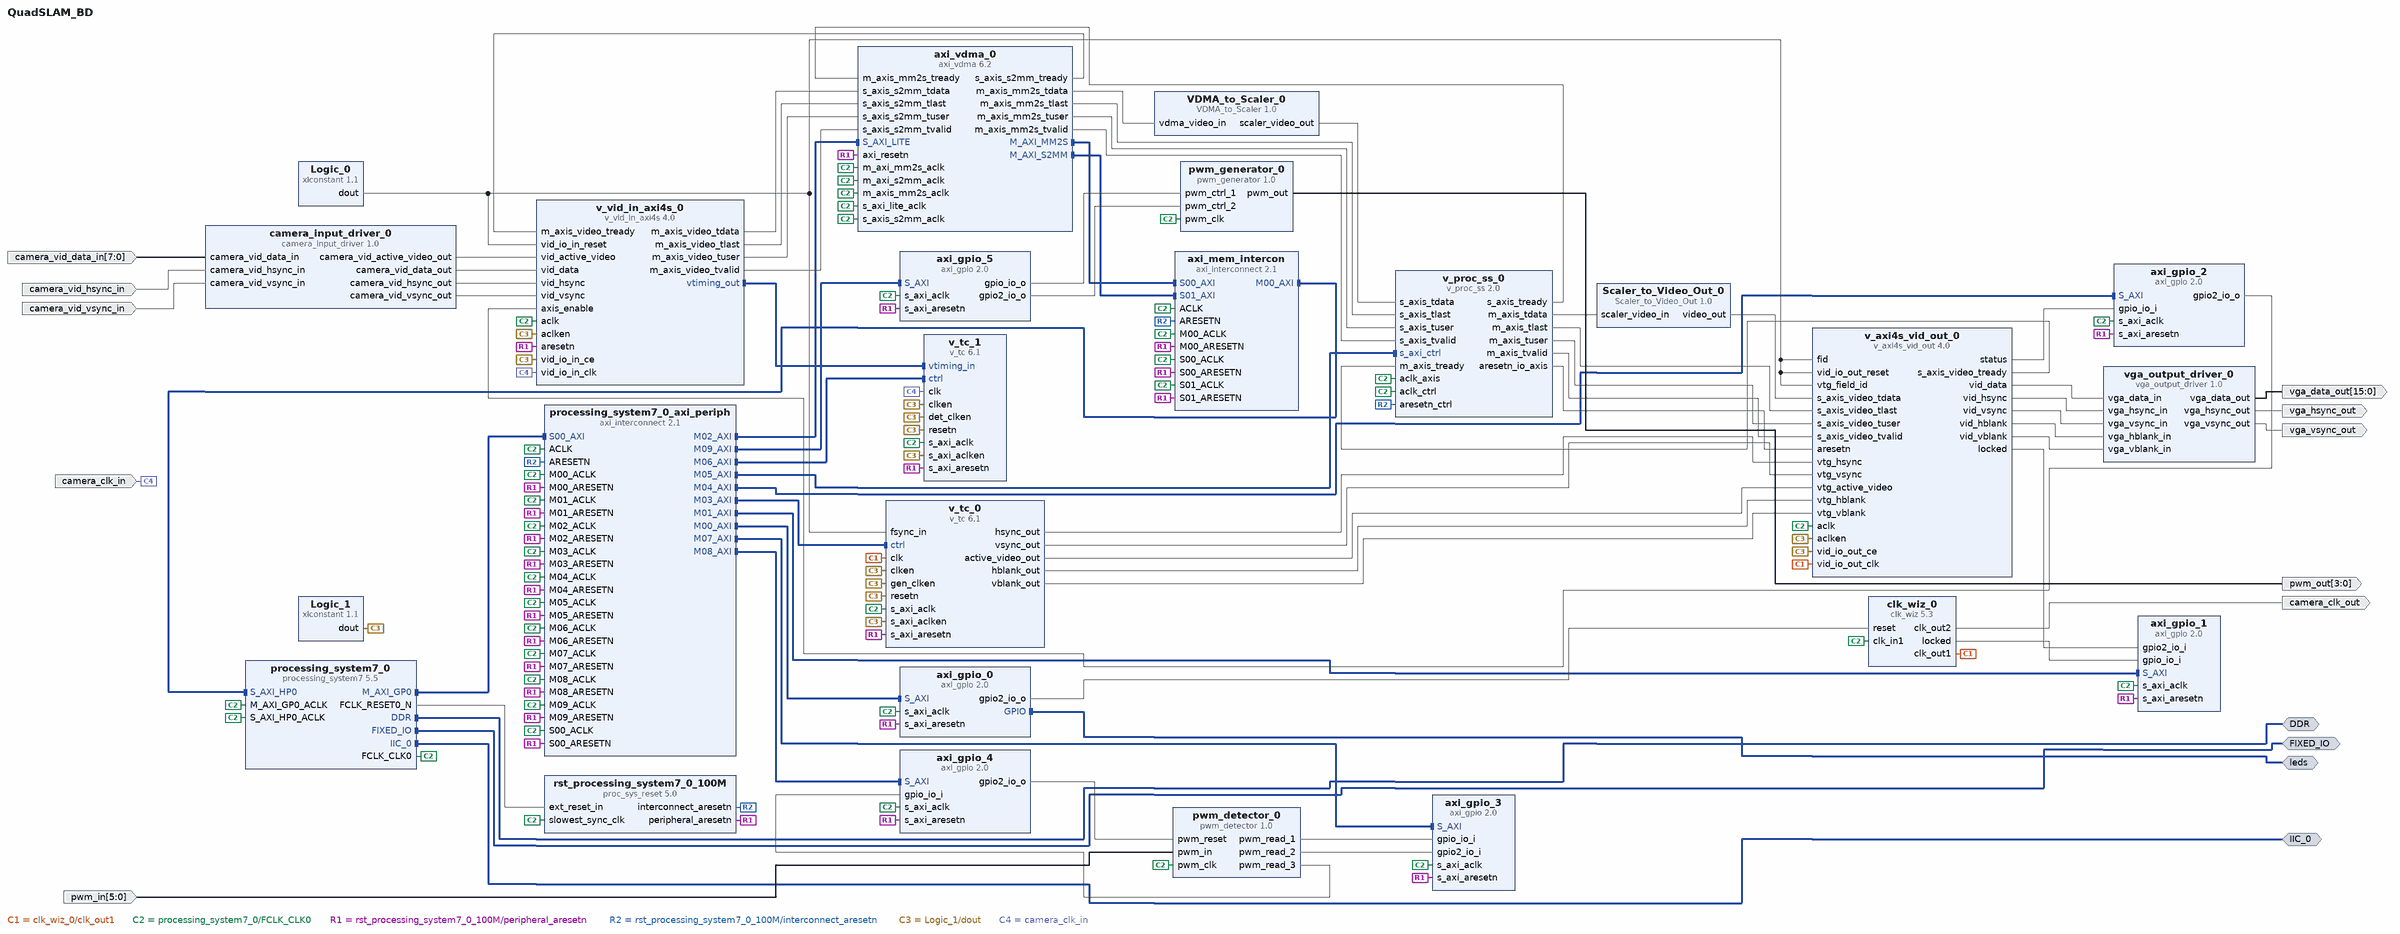
[diagram p0: block diagram of the top level]
# Vivado block design QuadSLAM_BD, Vivado 2016.2
create_bd_design QuadSLAM_BD

create_bd_intf_port -mode Master -vlnv xilinx.com:interface:ddrx_rtl:1.0 DDR
create_bd_intf_port -mode Master -vlnv xilinx.com:display_processing_system7:fixedio_rtl:1.0 FIXED_IO
create_bd_intf_port -mode Master -vlnv xilinx.com:interface:gpio_rtl:1.0 leds
create_bd_intf_port -mode Master -vlnv xilinx.com:interface:iic_rtl:1.0 IIC_0
create_bd_port -dir O -from 15 -to 0 vga_data_out
create_bd_port -dir O vga_hsync_out
create_bd_port -dir O vga_vsync_out
create_bd_port -dir I -from 7 -to 0 camera_vid_data_in
create_bd_port -dir I camera_vid_hsync_in
create_bd_port -dir I camera_vid_vsync_in
create_bd_port -dir I -type clk camera_clk_in
set_property -dict {CONFIG.FREQ_HZ 74250000} [get_bd_ports camera_clk_in]
create_bd_port -dir O -type clk camera_clk_out
create_bd_port -dir O -from 3 -to 0 pwm_out
create_bd_port -dir I -from 5 -to 0 pwm_in

create_bd_cell -type ip -vlnv xilinx.com:ip:processing_system7:5.5 processing_system7_0
set_property -dict [list \
  CONFIG.PCW_FPGA0_PERIPHERAL_FREQMHZ 130 \
  CONFIG.PCW_USE_S_AXI_HP0 1 \
  CONFIG.PCW_IMPORT_BOARD_PRESET C:/Users/NicholasKimball/Documents/School/Senior/CPE439/fpga-zynq-master/zybo/src/xml/ZYBO_zynq_def.xml \
  CONFIG.PCW_QSPI_GRP_SINGLE_SS_ENABLE 1 \
  CONFIG.PCW_WDT_PERIPHERAL_ENABLE 1 \
  CONFIG.PCW_TTC0_PERIPHERAL_ENABLE 1 \
  CONFIG.PCW_I2C1_PERIPHERAL_ENABLE 1 \
  CONFIG.PCW_I2C1_I2C1_IO {MIO 12 .. 13} \
] [get_bd_cells processing_system7_0]
# 2 more settings of processing_system7_0 are not shown: defaults, MIO pin electricals, DDR timing, and values the tool derives
create_bd_cell -type ip -vlnv xilinx.com:ip:axi_gpio:2.0 axi_gpio_0
set_property -dict [list \
  CONFIG.C_GPIO_WIDTH 4 \
  CONFIG.C_GPIO2_WIDTH 1 \
  CONFIG.C_IS_DUAL 1 \
  CONFIG.C_ALL_INPUTS_2 0 \
  CONFIG.C_ALL_OUTPUTS 1 \
  CONFIG.C_ALL_OUTPUTS_2 1 \
] [get_bd_cells axi_gpio_0]
create_bd_cell -type ip -vlnv xilinx.com:ip:proc_sys_reset:5.0 rst_processing_system7_0_100M
create_bd_cell -type ip -vlnv xilinx.com:ip:axi_gpio:2.0 axi_gpio_1
set_property -dict [list \
  CONFIG.C_GPIO_WIDTH 1 \
  CONFIG.C_GPIO2_WIDTH 1 \
  CONFIG.C_IS_DUAL 1 \
  CONFIG.C_ALL_INPUTS 1 \
  CONFIG.C_ALL_INPUTS_2 1 \
] [get_bd_cells axi_gpio_1]
create_bd_cell -type ip -vlnv xilinx.com:ip:axi_vdma:6.2 axi_vdma_0
set_property -dict [list \
  CONFIG.c_m_axis_mm2s_tdata_width 16 \
  CONFIG.c_include_s2mm_dre 1 \
  CONFIG.c_num_fstores 3 \
  CONFIG.c_use_s2mm_fsync 0 \
  CONFIG.c_s2mm_genlock_mode 2 \
  CONFIG.c_mm2s_linebuffer_depth 256 \
  CONFIG.c_s2mm_linebuffer_depth 256 \
  CONFIG.c_mm2s_max_burst_length 64 \
  CONFIG.c_s2mm_max_burst_length 64 \
  CONFIG.c_include_s2mm 1 \
  CONFIG.c_include_mm2s_dre 1 \
] [get_bd_cells axi_vdma_0]
create_bd_cell -type ip -vlnv xilinx.com:ip:v_tc:6.1 v_tc_0
set_property -dict [list \
  CONFIG.max_clocks_per_line 2048 \
  CONFIG.max_lines_per_frame 1024 \
  CONFIG.VIDEO_MODE 1024x768p \
  CONFIG.GEN_HSYNC_POLARITY Low \
  CONFIG.GEN_VSYNC_POLARITY Low \
  CONFIG.GEN_HBLANK_POLARITY Low \
  CONFIG.GEN_VBLANK_POLARITY Low \
  CONFIG.enable_detection false \
  CONFIG.vertical_blank_generation true \
  CONFIG.horizontal_blank_generation true \
  CONFIG.frame_syncs 1 \
] [get_bd_cells v_tc_0]
create_bd_cell -type ip -vlnv xilinx.com:ip:v_axi4s_vid_out:4.0 v_axi4s_vid_out_0
set_property -dict [list \
  CONFIG.C_PIXELS_PER_CLOCK 1 \
  CONFIG.C_S_AXIS_VIDEO_FORMAT 12 \
  CONFIG.C_S_AXIS_VIDEO_DATA_WIDTH 16 \
  CONFIG.C_NATIVE_COMPONENT_WIDTH 16 \
  CONFIG.C_HAS_ASYNC_CLK 1 \
  CONFIG.C_ADDR_WIDTH 5 \
  CONFIG.C_VTG_MASTER_SLAVE 1 \
] [get_bd_cells v_axi4s_vid_out_0]
create_bd_cell -type ip -vlnv xilinx.com:ip:xlconstant:1.1 Logic_0
set_property -dict {CONFIG.CONST_WIDTH 1 CONFIG.CONST_VAL 0} [get_bd_cells Logic_0]
create_bd_cell -type ip -vlnv xilinx.com:ip:xlconstant:1.1 Logic_1
create_bd_cell -type ip -vlnv xilinx.com:ip:axi_interconnect:2.1 processing_system7_0_axi_periph
set_property -dict {CONFIG.NUM_MI 10} [get_bd_cells processing_system7_0_axi_periph]
create_bd_cell -type ip -vlnv xilinx.com:ip:clk_wiz:5.3 clk_wiz_0
set_property -dict [list \
  CONFIG.CLKOUT2_USED true \
  CONFIG.NUM_OUT_CLKS 2 \
  CONFIG.CLKOUT1_REQUESTED_OUT_FREQ 65 \
  CONFIG.CLKOUT2_REQUESTED_OUT_FREQ 39.321 \
  CONFIG.PRIM_SOURCE No_buffer \
  CONFIG.CLKOUT1_DRIVES BUFGCE \
  CONFIG.CLKOUT2_DRIVES BUFGCE \
  CONFIG.CLKOUT3_DRIVES BUFGCE \
  CONFIG.CLKOUT4_DRIVES BUFGCE \
  CONFIG.CLKOUT5_DRIVES BUFGCE \
  CONFIG.CLKOUT6_DRIVES BUFGCE \
  CONFIG.CLKOUT7_DRIVES BUFGCE \
  CONFIG.FEEDBACK_SOURCE FDBK_AUTO \
  CONFIG.MMCM_DIVCLK_DIVIDE 5 \
  CONFIG.MMCM_CLKFBOUT_MULT_F 47.125 \
  CONFIG.MMCM_CLKOUT0_DIVIDE_F 18.125 \
  CONFIG.MMCM_CLKOUT1_DIVIDE 30 \
  CONFIG.USE_SAFE_CLOCK_STARTUP true \
  CONFIG.CLKOUT1_JITTER 193.721 \
  CONFIG.CLKOUT1_PHASE_ERROR 222.858 \
  CONFIG.CLKOUT2_JITTER 209.162 \
  CONFIG.CLKOUT2_PHASE_ERROR 222.858 \
] [get_bd_cells clk_wiz_0]
create_bd_cell -type ip -vlnv xilinx.com:ip:axi_interconnect:2.1 axi_mem_intercon
set_property -dict {CONFIG.NUM_SI 2 CONFIG.NUM_MI 1} [get_bd_cells axi_mem_intercon]
create_bd_cell -type ip -vlnv xilinx.com:ip:axi_gpio:2.0 axi_gpio_2
set_property -dict [list \
  CONFIG.C_GPIO2_WIDTH 1 \
  CONFIG.C_IS_DUAL 1 \
  CONFIG.C_ALL_INPUTS 1 \
  CONFIG.C_ALL_OUTPUTS_2 1 \
] [get_bd_cells axi_gpio_2]
create_bd_cell -type ip -vlnv xilinx.com:ip:v_vid_in_axi4s:4.0 v_vid_in_axi4s_0
set_property -dict [list \
  CONFIG.C_M_AXIS_VIDEO_FORMAT 12 \
  CONFIG.C_M_AXIS_VIDEO_DATA_WIDTH 8 \
  CONFIG.C_HAS_ASYNC_CLK 1 \
] [get_bd_cells v_vid_in_axi4s_0]
create_bd_cell -type ip -vlnv xilinx.com:user:vga_output_driver:1.0 vga_output_driver_0
create_bd_cell -type ip -vlnv xilinx.com:user:camera_input_driver:1.0 camera_input_driver_0
create_bd_cell -type ip -vlnv xilinx.com:user:Scaler_to_Video_Out:1.0 Scaler_to_Video_Out_0
create_bd_cell -type ip -vlnv xilinx.com:ip:v_proc_ss:2.0 v_proc_ss_0
set_property -dict [list \
  CONFIG.C_SCALER_ALGORITHM 1 \
  CONFIG.C_TOPOLOGY 0 \
  CONFIG.C_SAMPLES_PER_CLK 1 \
  CONFIG.C_MAX_DATA_WIDTH 8 \
  CONFIG.C_MAX_COLS 2560 \
  CONFIG.C_MAX_ROWS 2048 \
  CONFIG.C_ENABLE_INTERLACED false \
  CONFIG.C_ENABLE_DMA false \
  CONFIG.C_SCALER_ENABLE_422 false \
  CONFIG.C_DEINT_MOTION_ADAPTIVE false \
] [get_bd_cells v_proc_ss_0]
create_bd_cell -type ip -vlnv xilinx.com:user:VDMA_to_Scaler:1.0 VDMA_to_Scaler_0
create_bd_cell -type ip -vlnv xilinx.com:ip:v_tc:6.1 v_tc_1
set_property -dict [list \
  CONFIG.max_clocks_per_line 4096 \
  CONFIG.max_lines_per_frame 1024 \
  CONFIG.horizontal_blank_detection false \
  CONFIG.enable_generation false \
  CONFIG.vertical_blank_detection false \
] [get_bd_cells v_tc_1]
create_bd_cell -type ip -vlnv xilinx.com:ip:axi_gpio:2.0 axi_gpio_3
set_property -dict [list \
  CONFIG.C_GPIO_WIDTH 22 \
  CONFIG.C_GPIO2_WIDTH 22 \
  CONFIG.C_IS_DUAL 1 \
  CONFIG.C_ALL_INPUTS 1 \
  CONFIG.C_ALL_INPUTS_2 1 \
] [get_bd_cells axi_gpio_3]
create_bd_cell -type ip -vlnv xilinx.com:ip:axi_gpio:2.0 axi_gpio_4
set_property -dict [list \
  CONFIG.C_GPIO_WIDTH 22 \
  CONFIG.C_GPIO2_WIDTH 1 \
  CONFIG.C_IS_DUAL 1 \
  CONFIG.C_ALL_INPUTS 1 \
  CONFIG.C_ALL_OUTPUTS_2 1 \
] [get_bd_cells axi_gpio_4]
create_bd_cell -type ip -vlnv xilinx.com:ip:axi_gpio:2.0 axi_gpio_5
set_property -dict [list \
  CONFIG.C_GPIO_WIDTH 24 \
  CONFIG.C_GPIO2_WIDTH 22 \
  CONFIG.C_IS_DUAL 1 \
  CONFIG.C_ALL_OUTPUTS 1 \
  CONFIG.C_ALL_OUTPUTS_2 1 \
] [get_bd_cells axi_gpio_5]
create_bd_cell -type ip -vlnv xilinx.com:user:pwm_detector:1.0 pwm_detector_0
create_bd_cell -type ip -vlnv xilinx.com:user:pwm_generator:1.0 pwm_generator_0

# ---- connections ----

connect_bd_intf_net [get_bd_intf_pins processing_system7_0/M_AXI_GP0] [get_bd_intf_pins processing_system7_0_axi_periph/S00_AXI]
connect_bd_intf_net [get_bd_intf_pins processing_system7_0_axi_periph/M00_AXI] [get_bd_intf_pins axi_gpio_0/S_AXI]
connect_bd_intf_net [get_bd_intf_pins processing_system7_0_axi_periph/M01_AXI] [get_bd_intf_pins axi_gpio_1/S_AXI]
connect_bd_intf_net [get_bd_intf_pins processing_system7_0_axi_periph/M02_AXI] [get_bd_intf_pins axi_vdma_0/S_AXI_LITE]
connect_bd_intf_net [get_bd_intf_pins processing_system7_0_axi_periph/M03_AXI] [get_bd_intf_pins v_tc_0/ctrl]
connect_bd_intf_net [get_bd_intf_pins axi_vdma_0/M_AXI_MM2S] [get_bd_intf_pins axi_mem_intercon/S00_AXI]
connect_bd_intf_net [get_bd_intf_pins axi_mem_intercon/M00_AXI] [get_bd_intf_pins processing_system7_0/S_AXI_HP0]
connect_bd_intf_net [get_bd_intf_pins processing_system7_0_axi_periph/M04_AXI] [get_bd_intf_pins axi_gpio_2/S_AXI]
connect_bd_intf_net [get_bd_intf_pins axi_vdma_0/M_AXI_S2MM] [get_bd_intf_pins axi_mem_intercon/S01_AXI]
connect_bd_intf_net [get_bd_intf_pins processing_system7_0_axi_periph/M05_AXI] [get_bd_intf_pins v_proc_ss_0/s_axi_ctrl]
connect_bd_intf_net [get_bd_intf_pins v_vid_in_axi4s_0/vtiming_out] [get_bd_intf_pins v_tc_1/vtiming_in]
connect_bd_intf_net [get_bd_intf_pins processing_system7_0_axi_periph/M06_AXI] [get_bd_intf_pins v_tc_1/ctrl]
connect_bd_intf_net [get_bd_intf_pins processing_system7_0_axi_periph/M07_AXI] [get_bd_intf_pins axi_gpio_3/S_AXI]
connect_bd_intf_net [get_bd_intf_pins processing_system7_0_axi_periph/M08_AXI] [get_bd_intf_pins axi_gpio_4/S_AXI]
connect_bd_intf_net [get_bd_intf_pins processing_system7_0_axi_periph/M09_AXI] [get_bd_intf_pins axi_gpio_5/S_AXI]
connect_bd_intf_net [get_bd_intf_ports DDR] [get_bd_intf_pins processing_system7_0/DDR]
connect_bd_intf_net [get_bd_intf_ports FIXED_IO] [get_bd_intf_pins processing_system7_0/FIXED_IO]
connect_bd_intf_net [get_bd_intf_ports leds] [get_bd_intf_pins axi_gpio_0/GPIO]
connect_bd_intf_net [get_bd_intf_ports IIC_0] [get_bd_intf_pins processing_system7_0/IIC_0]
connect_bd_net [get_bd_pins processing_system7_0/FCLK_RESET0_N] [get_bd_pins rst_processing_system7_0_100M/ext_reset_in]
connect_bd_net [get_bd_pins clk_wiz_0/clk_out1] [get_bd_pins v_tc_0/clk] [get_bd_pins v_axi4s_vid_out_0/vid_io_out_clk]
connect_bd_net [get_bd_pins processing_system7_0/FCLK_CLK0] \
  [get_bd_pins axi_vdma_0/s_axi_lite_aclk] [get_bd_pins rst_processing_system7_0_100M/slowest_sync_clk] \
  [get_bd_pins v_tc_0/s_axi_aclk] [get_bd_pins v_axi4s_vid_out_0/aclk] [get_bd_pins axi_vdma_0/m_axi_mm2s_aclk] \
  [get_bd_pins axi_vdma_0/m_axis_mm2s_aclk] [get_bd_pins axi_gpio_1/s_axi_aclk] [get_bd_pins axi_gpio_0/s_axi_aclk] \
  [get_bd_pins processing_system7_0/M_AXI_GP0_ACLK] [get_bd_pins clk_wiz_0/clk_in1] \
  [get_bd_pins processing_system7_0/S_AXI_HP0_ACLK] [get_bd_pins axi_gpio_2/s_axi_aclk] \
  [get_bd_pins axi_vdma_0/m_axi_s2mm_aclk] [get_bd_pins v_vid_in_axi4s_0/aclk] [get_bd_pins axi_vdma_0/s_axis_s2mm_aclk] \
  [get_bd_pins v_proc_ss_0/aclk_ctrl] [get_bd_pins v_proc_ss_0/aclk_axis] [get_bd_pins v_tc_1/s_axi_aclk] \
  [get_bd_pins axi_gpio_3/s_axi_aclk] [get_bd_pins axi_gpio_4/s_axi_aclk] [get_bd_pins axi_gpio_5/s_axi_aclk] \
  [get_bd_pins pwm_detector_0/pwm_clk] [get_bd_pins pwm_generator_0/pwm_clk] \
  [get_bd_pins processing_system7_0_axi_periph/S00_ACLK] [get_bd_pins processing_system7_0_axi_periph/ACLK] \
  [get_bd_pins processing_system7_0_axi_periph/M00_ACLK] [get_bd_pins processing_system7_0_axi_periph/M01_ACLK] \
  [get_bd_pins processing_system7_0_axi_periph/M02_ACLK] [get_bd_pins processing_system7_0_axi_periph/M03_ACLK] \
  [get_bd_pins axi_mem_intercon/S00_ACLK] [get_bd_pins axi_mem_intercon/ACLK] [get_bd_pins axi_mem_intercon/M00_ACLK] \
  [get_bd_pins processing_system7_0_axi_periph/M04_ACLK] [get_bd_pins axi_mem_intercon/S01_ACLK] \
  [get_bd_pins processing_system7_0_axi_periph/M05_ACLK] [get_bd_pins processing_system7_0_axi_periph/M06_ACLK] \
  [get_bd_pins processing_system7_0_axi_periph/M07_ACLK] [get_bd_pins processing_system7_0_axi_periph/M08_ACLK] \
  [get_bd_pins processing_system7_0_axi_periph/M09_ACLK]
connect_bd_net [get_bd_pins rst_processing_system7_0_100M/peripheral_aresetn] \
  [get_bd_pins axi_vdma_0/axi_resetn] [get_bd_pins v_tc_0/s_axi_aresetn] [get_bd_pins axi_gpio_0/s_axi_aresetn] \
  [get_bd_pins axi_gpio_1/s_axi_aresetn] [get_bd_pins axi_gpio_2/s_axi_aresetn] [get_bd_pins v_vid_in_axi4s_0/aresetn] \
  [get_bd_pins v_tc_1/s_axi_aresetn] [get_bd_pins axi_gpio_3/s_axi_aresetn] [get_bd_pins axi_gpio_4/s_axi_aresetn] \
  [get_bd_pins axi_gpio_5/s_axi_aresetn] [get_bd_pins processing_system7_0_axi_periph/S00_ARESETN] \
  [get_bd_pins processing_system7_0_axi_periph/M00_ARESETN] [get_bd_pins processing_system7_0_axi_periph/M01_ARESETN] \
  [get_bd_pins processing_system7_0_axi_periph/M02_ARESETN] [get_bd_pins processing_system7_0_axi_periph/M03_ARESETN] \
  [get_bd_pins axi_mem_intercon/S00_ARESETN] [get_bd_pins axi_mem_intercon/M00_ARESETN] \
  [get_bd_pins processing_system7_0_axi_periph/M04_ARESETN] [get_bd_pins axi_mem_intercon/S01_ARESETN] \
  [get_bd_pins processing_system7_0_axi_periph/M05_ARESETN] [get_bd_pins processing_system7_0_axi_periph/M06_ARESETN] \
  [get_bd_pins processing_system7_0_axi_periph/M07_ARESETN] [get_bd_pins processing_system7_0_axi_periph/M08_ARESETN] \
  [get_bd_pins processing_system7_0_axi_periph/M09_ARESETN]
connect_bd_net -net xlconstant_0_dout [get_bd_pins Logic_0/dout] \
  [get_bd_pins v_tc_0/fsync_in] [get_bd_pins v_axi4s_vid_out_0/vid_io_out_reset] [get_bd_pins v_axi4s_vid_out_0/fid] \
  [get_bd_pins v_axi4s_vid_out_0/vtg_field_id] [get_bd_pins v_vid_in_axi4s_0/vid_io_in_reset]
connect_bd_net [get_bd_pins rst_processing_system7_0_100M/interconnect_aresetn] \
  [get_bd_pins v_proc_ss_0/aresetn_ctrl] [get_bd_pins processing_system7_0_axi_periph/ARESETN] \
  [get_bd_pins axi_mem_intercon/ARESETN]
connect_bd_net [get_bd_pins clk_wiz_0/locked] [get_bd_pins axi_gpio_1/gpio_io_i]
connect_bd_net -net xlconstant_1_dout [get_bd_pins Logic_1/dout] \
  [get_bd_pins v_tc_0/clken] [get_bd_pins v_tc_0/s_axi_aclken] [get_bd_pins v_tc_0/resetn] \
  [get_bd_pins v_axi4s_vid_out_0/vid_io_out_ce] [get_bd_pins v_axi4s_vid_out_0/aclken] [get_bd_pins v_tc_0/gen_clken] \
  [get_bd_pins v_vid_in_axi4s_0/aclken] [get_bd_pins v_vid_in_axi4s_0/vid_io_in_ce] [get_bd_pins v_tc_1/resetn] \
  [get_bd_pins v_tc_1/det_clken] [get_bd_pins v_tc_1/s_axi_aclken] [get_bd_pins v_tc_1/clken]
connect_bd_net [get_bd_pins v_tc_0/hsync_out] [get_bd_pins v_axi4s_vid_out_0/vtg_hsync]
connect_bd_net [get_bd_pins v_tc_0/vsync_out] [get_bd_pins v_axi4s_vid_out_0/vtg_vsync]
connect_bd_net [get_bd_pins axi_gpio_0/gpio2_io_o] [get_bd_pins clk_wiz_0/reset]
connect_bd_net [get_bd_pins v_axi4s_vid_out_0/locked] [get_bd_pins axi_gpio_1/gpio2_io_i]
connect_bd_net [get_bd_pins v_axi4s_vid_out_0/status] [get_bd_pins axi_gpio_2/gpio_io_i]
connect_bd_net [get_bd_pins v_tc_0/active_video_out] [get_bd_pins v_axi4s_vid_out_0/vtg_active_video]
connect_bd_net [get_bd_pins v_tc_0/hblank_out] [get_bd_pins v_axi4s_vid_out_0/vtg_hblank]
connect_bd_net [get_bd_pins v_tc_0/vblank_out] [get_bd_pins v_axi4s_vid_out_0/vtg_vblank]
connect_bd_net [get_bd_pins v_axi4s_vid_out_0/vid_data] [get_bd_pins vga_output_driver_0/vga_data_in]
connect_bd_net [get_bd_pins v_axi4s_vid_out_0/vid_hsync] [get_bd_pins vga_output_driver_0/vga_hsync_in]
connect_bd_net [get_bd_pins v_axi4s_vid_out_0/vid_vsync] [get_bd_pins vga_output_driver_0/vga_vsync_in]
connect_bd_net [get_bd_pins v_axi4s_vid_out_0/vid_hblank] [get_bd_pins vga_output_driver_0/vga_hblank_in]
connect_bd_net [get_bd_pins v_axi4s_vid_out_0/vid_vblank] [get_bd_pins vga_output_driver_0/vga_vblank_in]
connect_bd_net [get_bd_pins vga_output_driver_0/vga_data_out] [get_bd_ports vga_data_out]
connect_bd_net [get_bd_pins vga_output_driver_0/vga_hsync_out] [get_bd_ports vga_hsync_out]
connect_bd_net [get_bd_pins vga_output_driver_0/vga_vsync_out] [get_bd_ports vga_vsync_out]
connect_bd_net [get_bd_pins camera_input_driver_0/camera_vid_active_video_out] [get_bd_pins v_vid_in_axi4s_0/vid_active_video]
connect_bd_net [get_bd_pins camera_input_driver_0/camera_vid_data_out] [get_bd_pins v_vid_in_axi4s_0/vid_data]
connect_bd_net [get_bd_pins camera_input_driver_0/camera_vid_hsync_out] [get_bd_pins v_vid_in_axi4s_0/vid_hsync]
connect_bd_net [get_bd_pins camera_input_driver_0/camera_vid_vsync_out] [get_bd_pins v_vid_in_axi4s_0/vid_vsync]
connect_bd_net [get_bd_ports camera_vid_data_in] [get_bd_pins camera_input_driver_0/camera_vid_data_in]
connect_bd_net [get_bd_ports camera_vid_hsync_in] [get_bd_pins camera_input_driver_0/camera_vid_hsync_in]
connect_bd_net [get_bd_ports camera_vid_vsync_in] [get_bd_pins camera_input_driver_0/camera_vid_vsync_in]
connect_bd_net -net vid_io_in_clk_1 [get_bd_ports camera_clk_in] [get_bd_pins v_vid_in_axi4s_0/vid_io_in_clk] [get_bd_pins v_tc_1/clk]
connect_bd_net [get_bd_pins clk_wiz_0/clk_out2] [get_bd_ports camera_clk_out]
connect_bd_net [get_bd_pins axi_vdma_0/m_axis_mm2s_tdata] [get_bd_pins VDMA_to_Scaler_0/vdma_video_in]
connect_bd_net [get_bd_pins Scaler_to_Video_Out_0/video_out] [get_bd_pins v_axi4s_vid_out_0/s_axis_video_tdata]
connect_bd_net [get_bd_pins v_proc_ss_0/m_axis_tdata] [get_bd_pins Scaler_to_Video_Out_0/scaler_video_in]
connect_bd_net [get_bd_pins v_proc_ss_0/m_axis_tlast] [get_bd_pins v_axi4s_vid_out_0/s_axis_video_tlast]
connect_bd_net [get_bd_pins v_axi4s_vid_out_0/s_axis_video_tready] [get_bd_pins v_proc_ss_0/m_axis_tready]
connect_bd_net [get_bd_pins v_proc_ss_0/m_axis_tuser] [get_bd_pins v_axi4s_vid_out_0/s_axis_video_tuser]
connect_bd_net [get_bd_pins v_proc_ss_0/m_axis_tvalid] [get_bd_pins v_axi4s_vid_out_0/s_axis_video_tvalid]
connect_bd_net [get_bd_pins v_proc_ss_0/aresetn_io_axis] [get_bd_pins v_axi4s_vid_out_0/aresetn]
connect_bd_net [get_bd_pins VDMA_to_Scaler_0/scaler_video_out] [get_bd_pins v_proc_ss_0/s_axis_tdata]
connect_bd_net [get_bd_pins axi_vdma_0/m_axis_mm2s_tlast] [get_bd_pins v_proc_ss_0/s_axis_tlast]
connect_bd_net [get_bd_pins v_proc_ss_0/s_axis_tready] [get_bd_pins axi_vdma_0/m_axis_mm2s_tready]
connect_bd_net [get_bd_pins axi_vdma_0/m_axis_mm2s_tuser] [get_bd_pins v_proc_ss_0/s_axis_tuser]
connect_bd_net [get_bd_pins axi_vdma_0/m_axis_mm2s_tvalid] [get_bd_pins v_proc_ss_0/s_axis_tvalid]
connect_bd_net [get_bd_pins v_vid_in_axi4s_0/m_axis_video_tdata] [get_bd_pins axi_vdma_0/s_axis_s2mm_tdata]
connect_bd_net [get_bd_pins v_vid_in_axi4s_0/m_axis_video_tlast] [get_bd_pins axi_vdma_0/s_axis_s2mm_tlast]
connect_bd_net [get_bd_pins v_vid_in_axi4s_0/m_axis_video_tuser] [get_bd_pins axi_vdma_0/s_axis_s2mm_tuser]
connect_bd_net [get_bd_pins v_vid_in_axi4s_0/m_axis_video_tvalid] [get_bd_pins axi_vdma_0/s_axis_s2mm_tvalid]
connect_bd_net [get_bd_pins axi_vdma_0/s_axis_s2mm_tready] [get_bd_pins v_vid_in_axi4s_0/m_axis_video_tready]
connect_bd_net [get_bd_pins axi_gpio_2/gpio2_io_o] [get_bd_pins v_vid_in_axi4s_0/axis_enable]
connect_bd_net [get_bd_pins axi_gpio_5/gpio_io_o] [get_bd_pins pwm_generator_0/pwm_ctrl_1]
connect_bd_net [get_bd_pins axi_gpio_5/gpio2_io_o] [get_bd_pins pwm_generator_0/pwm_ctrl_2]
connect_bd_net [get_bd_pins pwm_generator_0/pwm_out] [get_bd_ports pwm_out]
connect_bd_net [get_bd_pins pwm_detector_0/pwm_read_1] [get_bd_pins axi_gpio_3/gpio_io_i]
connect_bd_net [get_bd_pins pwm_detector_0/pwm_read_2] [get_bd_pins axi_gpio_3/gpio2_io_i]
connect_bd_net [get_bd_ports pwm_in] [get_bd_pins pwm_detector_0/pwm_in]
connect_bd_net [get_bd_pins pwm_detector_0/pwm_read_3] [get_bd_pins axi_gpio_4/gpio_io_i]
connect_bd_net [get_bd_pins axi_gpio_4/gpio2_io_o] [get_bd_pins pwm_detector_0/pwm_reset]

# ---- address map ----
assign_bd_address -offset 0x00000000 -range 512M -target_address_space [get_bd_addr_spaces axi_vdma_0/Data_MM2S] [get_bd_addr_segs processing_system7_0/S_AXI_HP0/HP0_DDR_LOWOCM]
assign_bd_address -offset 0x00000000 -range 512M -target_address_space [get_bd_addr_spaces axi_vdma_0/Data_S2MM] [get_bd_addr_segs processing_system7_0/S_AXI_HP0/HP0_DDR_LOWOCM]
assign_bd_address -offset 0x41200000 -range 64K -target_address_space [get_bd_addr_spaces processing_system7_0/Data] [get_bd_addr_segs axi_gpio_0/S_AXI/Reg]
assign_bd_address -offset 0x41210000 -range 64K -target_address_space [get_bd_addr_spaces processing_system7_0/Data] [get_bd_addr_segs axi_gpio_1/S_AXI/Reg]
assign_bd_address -offset 0x41220000 -range 64K -target_address_space [get_bd_addr_spaces processing_system7_0/Data] [get_bd_addr_segs axi_gpio_2/S_AXI/Reg]
assign_bd_address -offset 0x41230000 -range 64K -target_address_space [get_bd_addr_spaces processing_system7_0/Data] [get_bd_addr_segs axi_gpio_3/S_AXI/Reg]
assign_bd_address -offset 0x41240000 -range 64K -target_address_space [get_bd_addr_spaces processing_system7_0/Data] [get_bd_addr_segs axi_gpio_4/S_AXI/Reg]
assign_bd_address -offset 0x41250000 -range 64K -target_address_space [get_bd_addr_spaces processing_system7_0/Data] [get_bd_addr_segs axi_gpio_5/S_AXI/Reg]
assign_bd_address -offset 0x43000000 -range 64K -target_address_space [get_bd_addr_spaces processing_system7_0/Data] [get_bd_addr_segs axi_vdma_0/S_AXI_LITE/Reg]
assign_bd_address -offset 0x43C00000 -range 64K -target_address_space [get_bd_addr_spaces processing_system7_0/Data] [get_bd_addr_segs v_tc_0/ctrl/Reg]
assign_bd_address -offset 0x43C10000 -range 64K -target_address_space [get_bd_addr_spaces processing_system7_0/Data] [get_bd_addr_segs v_tc_1/ctrl/Reg]
assign_bd_address -offset 0x43C40000 -range 256K -target_address_space [get_bd_addr_spaces processing_system7_0/Data] [get_bd_addr_segs v_proc_ss_0/s_axi_ctrl/Reg]

validate_bd_design
save_bd_design
